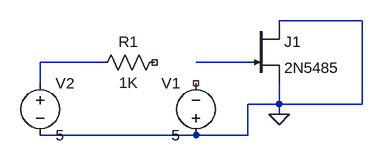
[diagram p0: schematic Draft1.asc]
Draft1.asc, the LTspice schematic file:
Version 4
SHEET 1 880 680
WIRE 304 80 176 80
WIRE -96 144 -192 144
WIRE 128 144 48 144
WIRE -192 176 -192 144
WIRE 176 208 176 176
WIRE 176 208 128 208
WIRE 304 208 304 80
WIRE 304 208 176 208
WIRE 176 224 176 208
WIRE 48 256 -192 256
WIRE 128 256 128 208
WIRE 128 256 48 256
FLAG 176 224 0
SYMBOL njf 128 80 R0
SYMATTR InstName J1
SYMATTR Value 2N5485
SYMBOL res 0 128 R90
WINDOW 0 0 56 VBottom 2
WINDOW 3 32 56 VTop 2
SYMATTR InstName R1
SYMATTR Value 1K
SYMATTR SpiceLine tol=1 pwr=0.1
SYMBOL voltage 48 272 R180
WINDOW 0 24 96 Left 2
WINDOW 3 24 16 Left 2
WINDOW 123 0 0 Left 0
WINDOW 39 0 0 Left 0
SYMATTR InstName V1
SYMATTR Value 5
SYMBOL voltage -192 160 R0
WINDOW 123 0 0 Left 0
WINDOW 39 0 0 Left 0
SYMATTR InstName V2
SYMATTR Value 5

The netlist it stands for:
* Draft1.asc
J1 0 N002 0 2N5485
R1 NC_01 N001 1K tol=1 pwr=0.1
V1 0 NC_02 5
V2 N001 0 5
.model NJF NJF
.model PJF PJF
.lib standard.jft
.backanno
.end